# EAGLE design Ultra_Water (EAGLE 7.5.0)
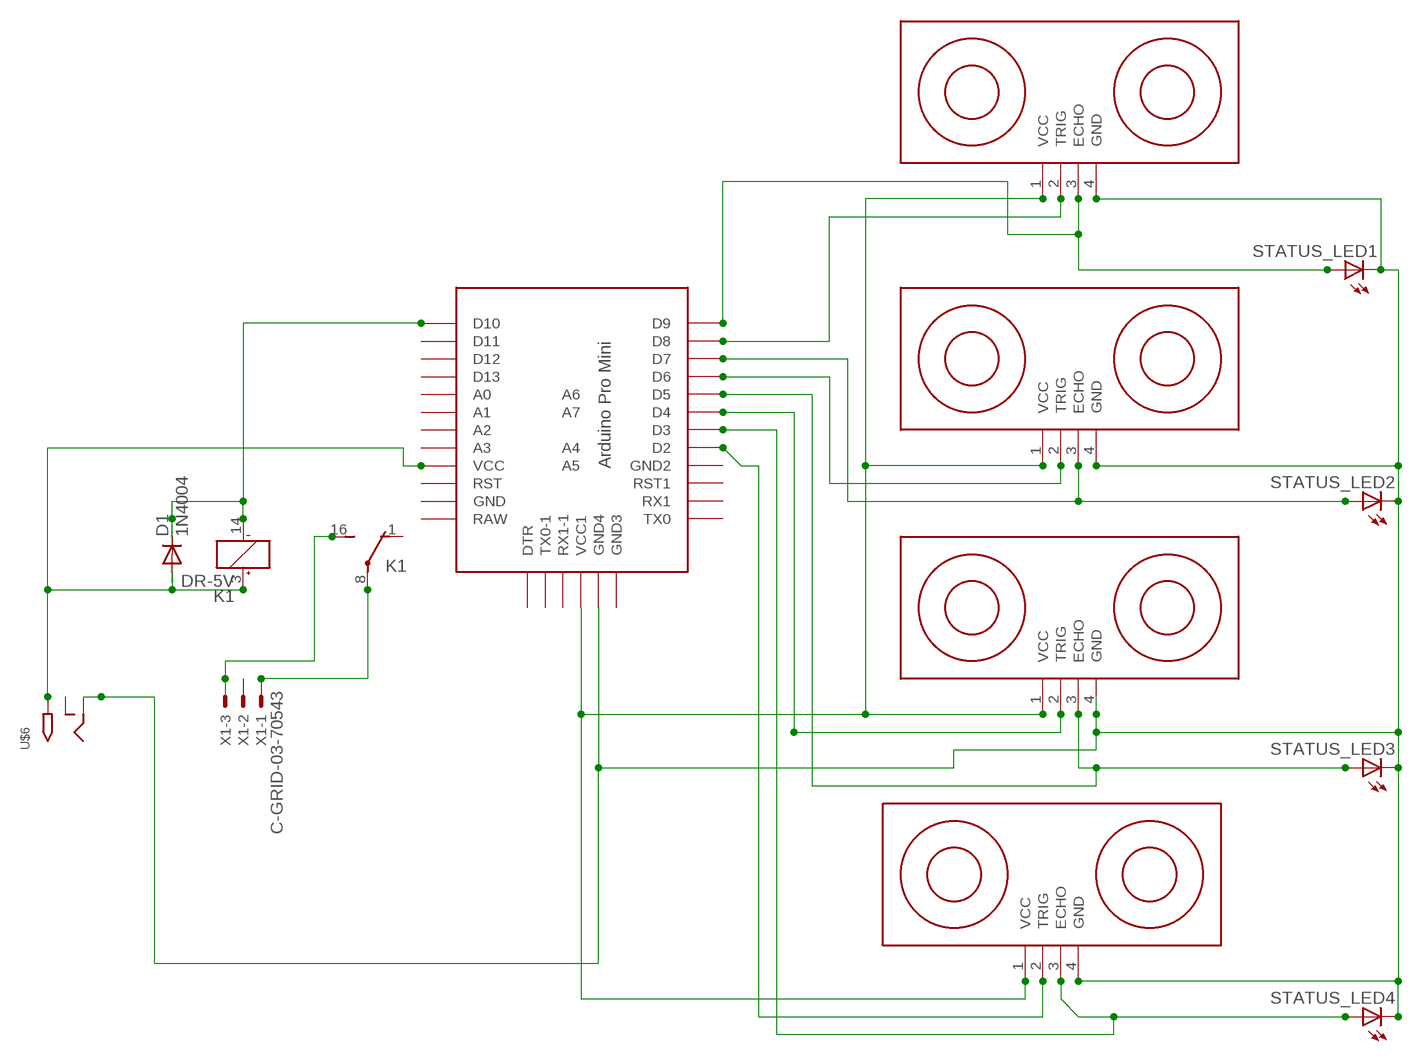
[diagram p0: schematic, sheet 1]

## Parts
D1  1N4004  [DO41-10]
K1  DR-5V  [DR-1]
STATUS_LED1  LED5MM  [LED5MM]
STATUS_LED2  LED5MM  [LED5MM]
STATUS_LED3  LED5MM  [LED5MM]
STATUS_LED4  LED5MM  [LED5MM]
U$1  PRO-MINI-2  [PRO-MINI-2]
U$2  ULTRASONIC-HC-SR04  [ULTRASONIC-HC-SR04]
U$3  ULTRASONIC-HC-SR04  [ULTRASONIC-HC-SR04]
U$4  ULTRASONIC-HC-SR04  [ULTRASONIC-HC-SR04]
U$5  ULTRASONIC-HC-SR04  [ULTRASONIC-HC-SR04]
U$6  2.1MMJACKTHM  [PJ-102A]
X1  C-GRID-03-70543  [70543-03]

## Nets
N$1: U$1.VCC1 U$2.1(VCC) U$3.1(VCC) U$4.1(VCC) U$5.1(VCC)
N$2: U$1.D4 U$4.2(TRIG)
N$4: STATUS_LED2.A U$1.D7 U$3.3(ECHO)
N$5: STATUS_LED1.A U$1.D9 U$2.3(ECHO)
N$6: STATUS_LED4.A U$1.D3 U$5.3(ECHO)
N$8: D1.C K1.14(-1:-) U$1.D10
N$9: D1.A K1.3(-1:+) U$1.VCC U$6.TIP
N$10: K1.8(-2:P) X1.1
N$11: STATUS_LED1.K(C) STATUS_LED2.K(C) STATUS_LED3.K(C) STATUS_LED4.K(C) U$1.GND3(GND4) U$2.4(GND) U$3.4(GND) U$4.4(GND) U$5.4(GND) U$6.RING
N$12: K1.16(-2:S) X1.3
N$13: U$1.D8 U$2.2(TRIG)
N$14: U$1.D2 U$5.2(TRIG)
N$15: U$1.D6 U$3.2(TRIG)
N$16: STATUS_LED3.A U$1.D5 U$4.3(ECHO)
Unconnected: K1.1(-2:O) U$1.A0 U$1.A1 U$1.A2 U$1.A3 U$1.A4 U$1.A5 U$1.A6 U$1.A7 U$1.D11 U$1.D12 U$1.D13 U$1.DTR U$1.GND U$1.GND1(GND2) U$1.GND2(GND3) U$1.RAW U$1.RST U$1.RST1 U$1.RX1 U$1.RX1-1 U$1.TX0 U$1.TX0-1 U$6.RING_SW X1.2

## Library data of the parts
D1 = diode:1N4004: DIODE general purpose rectifier, 1 A
K1 = relay:DR-*V: HIGHLY RELIABLE MINIATURE DIP RELAYS NAiS Source: www.mew-europe.com/ac/download/ datasheet/relay/dr_en.pdf; MPN: DR-5V; OC_FARNELL: 1124065; OC_NEWARK: 24M1478
STATUS_LED1-STATUS_LED4 = adafruit:LED: LED OSRAM: - CHIPLED LG R971, LG N971, LY N971, LG Q971, LY Q971, LO R971, LY R971 LH N974, LH R974 LS Q976, LO Q976, LY Q976 LO Q996 - Hyper CHIPLED LW Q18S LB Q993, LB Q99A, LB R99A - SideLED LS A670, LO A670, LY A670, LG A670, LP A670 LB A673, LV A673, LT A673, LW A673 LH A674 LY A675 LS A676, LA A676, LO A676, LY A676, LW A676 LS A679, LY A679, LG A679 - Hyper Micro SIDELED® LS Y876, LA Y876, LO Y876, LY Y876 LT Y87S - SmartLED LW L88C, LW L88S LB L89C, LB L89S, LG L890 LS L89K, LO L89K, LY L89K LS L896, LA L896, LO L896, LY L896 - TOPLED LS T670, LO T670, LY T670, LG T670, LP T670 LSG T670, LSP T670, LSY T670, LOP T670, LYG T670 LG T671, LOG T671, LSG T671 LB T673, LV T673, LT T673, LW T673 LH T674 LS T676, LA T676, LO T676, LY T676, LB T676, LH T676, LSB T676, LW T676 LB T67C, LV T67C, LT T67C, LS T67K, LO T67K, LY T67K, LW E67C LS E67B, LA E67B, LO E67B, LY E67B, LB E67C, LV E67C, LT E67C LW T67C LS T679, LY T679, LG T679 LS T770, LO T770, LY T770, LG T770, LP T770 LB T773, LV T773, LT T773, LW T773 LH T774 LS E675, LA E675, LY E675, LS T675 LS T776, LA T776, LO T776, LY T776, LB T776 LHGB T686 LT T68C, LB T68C - Hyper Mini TOPLED® LB M676 - Mini TOPLED Santana® LG M470 LS M47K, LO M47K, LY M47K Source: http://www.osram.convergy.de/
U$1 = Arduino-clone:PRO-MINI-2: Arduino Pro Mini Layout 2 Sparkfun.com
U$2-U$5 = diy-modules:ULTRASONIC-HC-SR04: Ultrasonic Ranging Module HC-SR04
U$6 = adafruit:2.1MMJACK: 2.1mm x 5.5mm THM DC jack with internal switch. Digikey part #PJ-102A, 4UCON part #05537 2.1mm x 5.5mm SMT DC jack with internal switch. Digikey part #PJ-002A-SMT, 4UCON part #03267 By microbuilder.eu & adafruit.com
X1 = con-molex:C-GRID-03: CONNECTOR wire to board 2.54 mm (0.100") pitch header; OC_FARNELL: unknown; OC_NEWARK: unknown

## Board
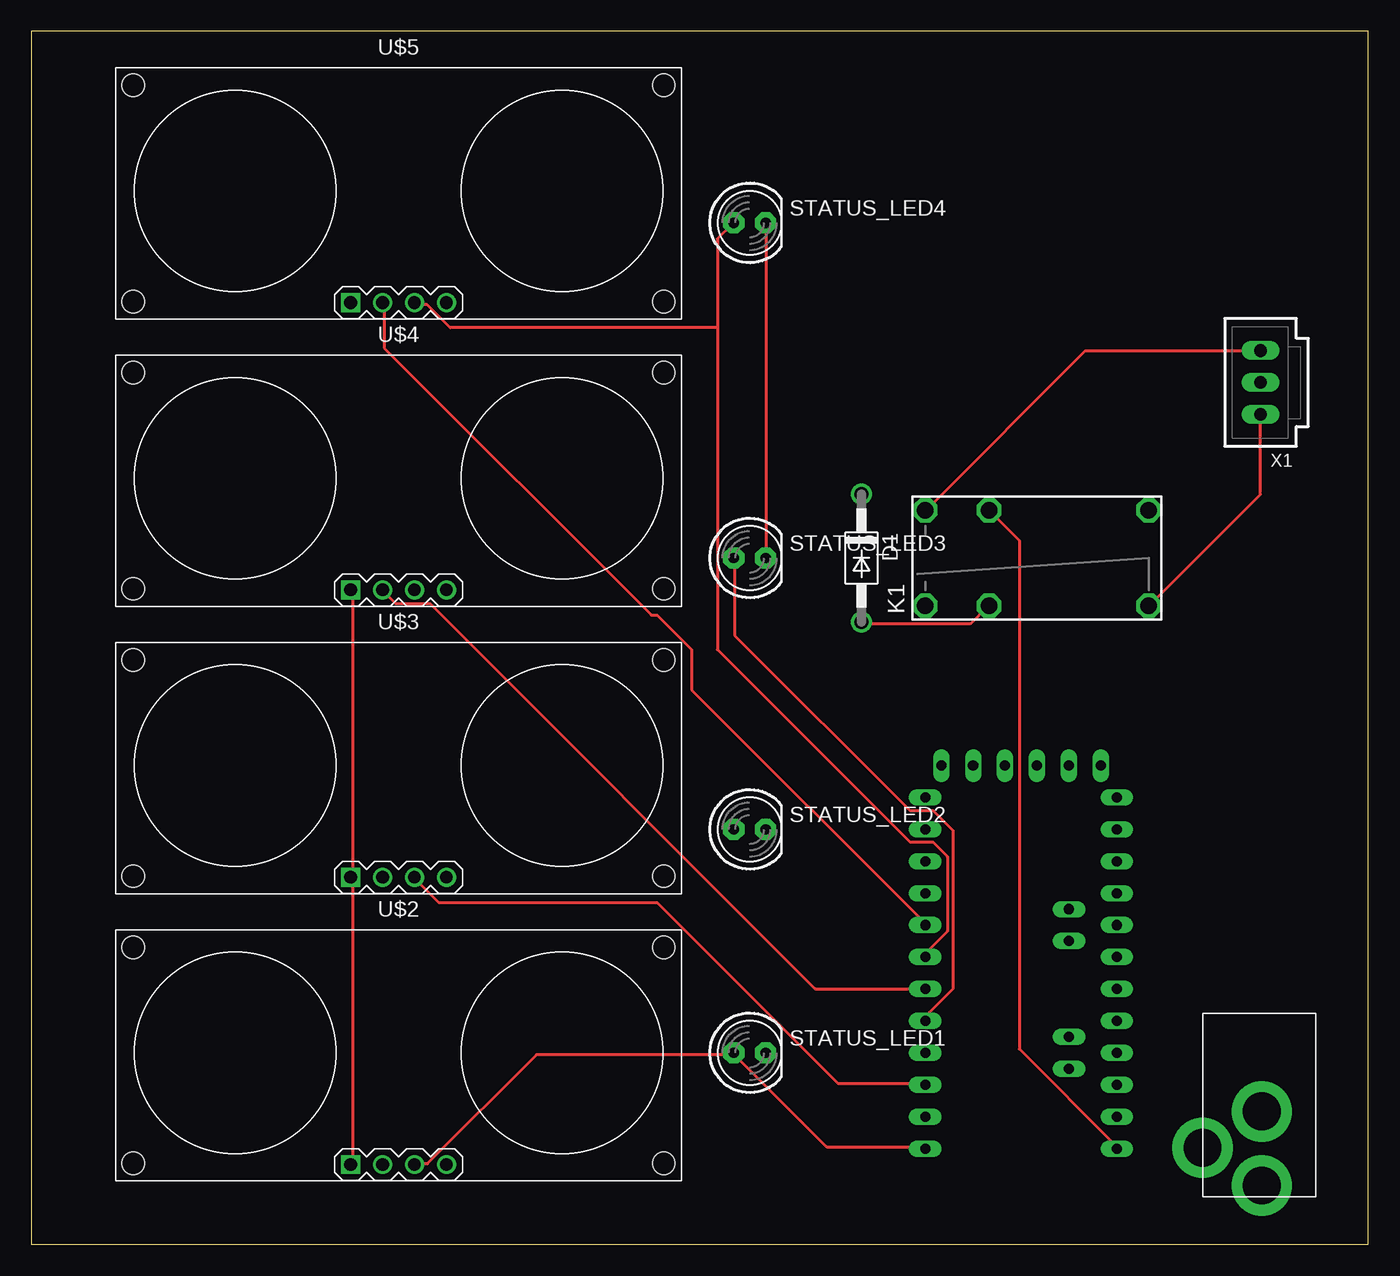
[diagram p1: board, top side]
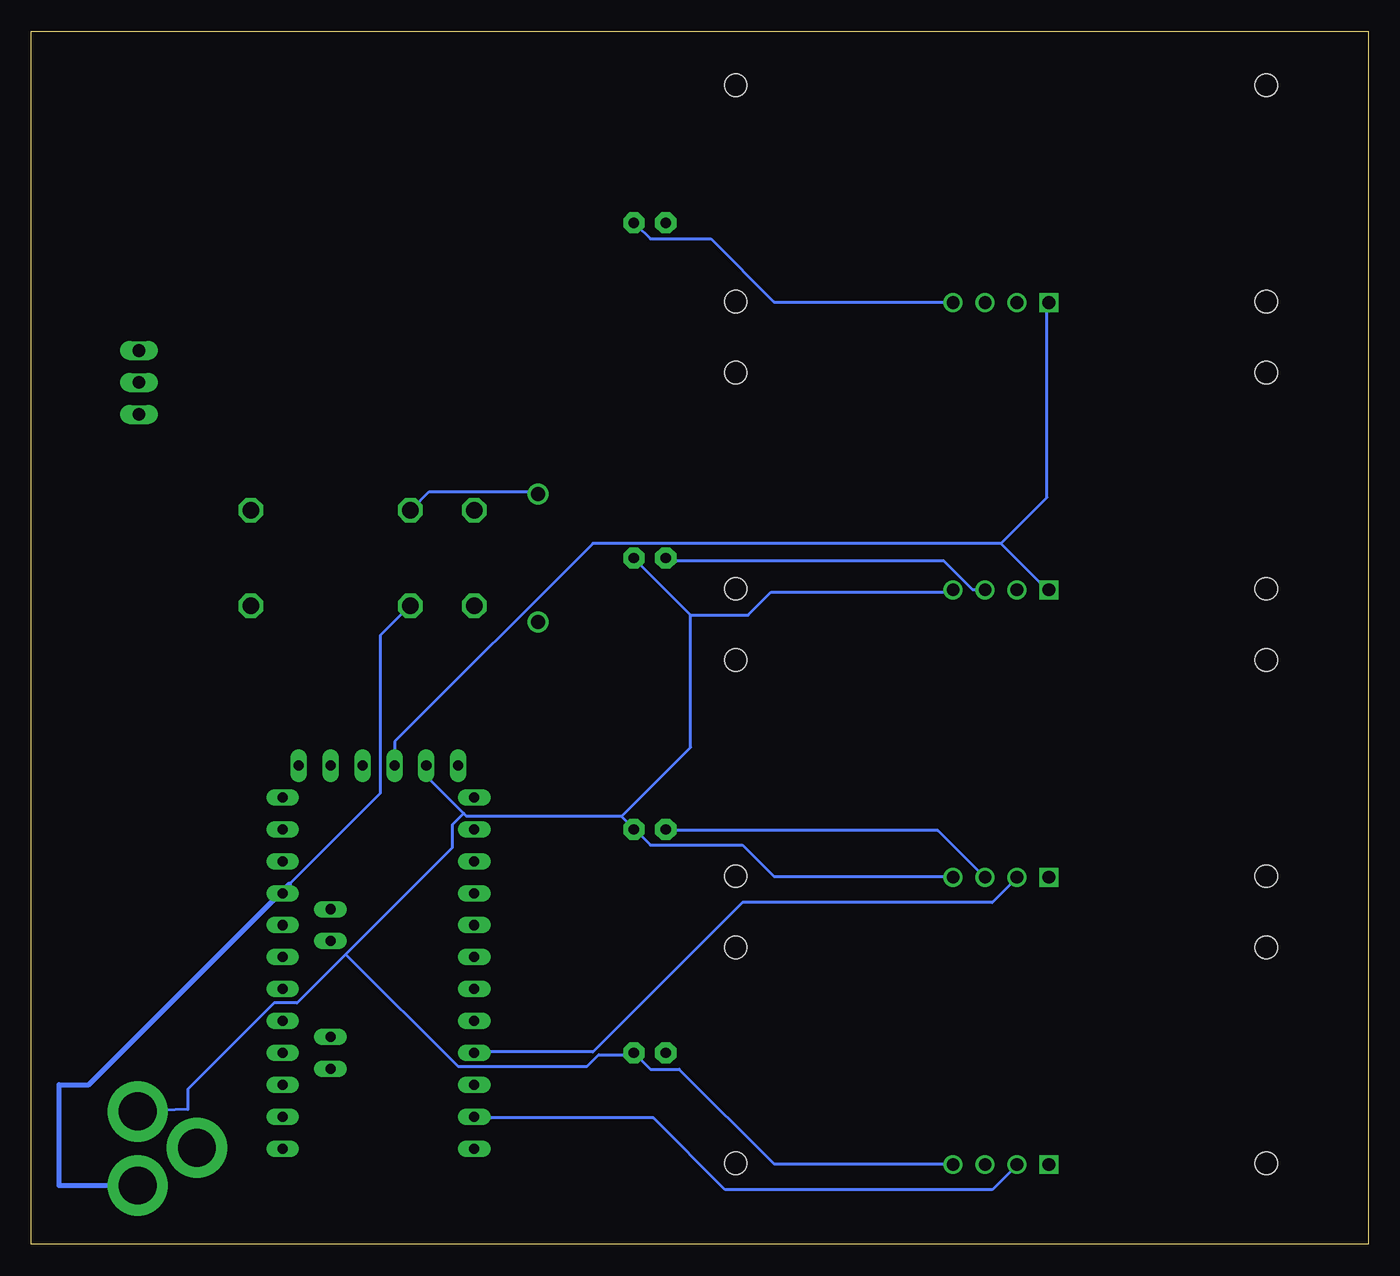
[diagram p2: board, bottom side, seen from below]

Size 106.35 x 96.51 mm. Coordinates in mm from the lower left corner, seen from the top.
Outline: 0,0 106.35,0 106.35,96.51 0,96.51 0,0
Copper layers (1*16): Top 0.035mm / dielectric 1.5mm / Bottom 0.035mm
Design rules "default": minimum track width 10mil, minimum drill 24mil, track to track 8mil, track to pad 8mil, pad to pad 8mil, via to via 8mil, smd to smd 8mil, copper to edge 40mil, drill to drill 8mil, minimum pad ring 10mil, minimum via ring 8mil, stop-mask expansion 4mil, vias tented up to drill 0mil, thermal gap 10mil

### Footprints (pad centres in the part's own frame; a part is rotated, then mirrored left to right if it is on the bottom)
DO41-10 = drill 1.118: A 5.08,0; C -5.08,0
DR-1 = drill 1.3 octagon: 1 -8.89,-3.81; 3 -3.81,-3.81; 8 8.89,-3.81; 9 8.89,3.81; 14 -3.81,3.81; 16 -8.89,3.81
LED5MM = drill 0.813 pad 1.676 octagon: A -1.27,0; K 1.27,0
PRO-MINI-2 = drill 0.8 long: A0 6.35,2.54; A1 6.35,0; A2 6.35,-2.54; A3 6.35,-5.08; A4 2.54,1.27; A5 2.54,3.81; A6 2.54,-8.89; A7 2.54,-6.35; D2 -8.89,2.54; D3 -8.89,0; D4 -8.89,-2.54; D5 -8.89,-5.08; D6 -8.89,-7.62; D7 -8.89,-10.16; D8 -8.89,-12.7; D9 -8.89,-15.24; D10 6.35,-15.24; D11 6.35,-12.7; D12 6.35,-10.16; D13 6.35,-7.62; DTR 5.08,15.24; GND 6.35,10.16; GND1 -8.89,5.08; GND2 -7.62,15.24; GND3 -5.08,15.24; RAW 6.35,12.7; RST 6.35,7.62; RST1 -8.89,7.62; RX1 -8.89,10.16; RX1-1 0,15.24; TX0 -8.89,12.7; TX0-1 2.54,15.24; VCC 6.35,5.08; VCC1 -2.54,15.24
ULTRASONIC-HC-SR04 = drill 1 square: 1 -3.81,-8.89 | drill 1: 2 -1.27,-8.89; 3 1.27,-8.89; 4 3.81,-8.89 | hole 1.8: -21.1,8.4; -21.1,-8.8; 21.1,-8.8; 21.1,8.4
PJ-102A = drill 3 pad 4.8: RING 0.1,-3.39; RING_SW -4.6,-6.29; TIP 0.1,-9.29
70543-03 = drill 1.016 long: 1 -2.54,0; 2 0,0; 3 2.54,0

### Placement (x,y rotation side)
D1  66.04,54.61 270 top
K1  80.01,54.61 0 top
STATUS_LED1  57.15,15.24 0 top
STATUS_LED2  57.15,33.02 0 top
STATUS_LED3  57.15,54.61 0 top
STATUS_LED4  57.15,81.28 0 top
U$1  80.01,22.86 0 top
U$2  29.21,15.24 0 top
U$3  29.21,38.1 0 top
U$4  29.21,60.96 0 top
U$5  29.21,83.82 0 top
U$6  97.79,13.97 0 top
X1  97.79,68.58 90 top

### Tracks (layer width: path | path; a pad name or v marks a point on that pad's centre or on a via)
N$1
  Top 0.254: U$2.1 25.55,6.4 25.55,29.03 U$3.1 25.55,29.26 25.55,51.89 U$4.1
  Bottom 0.254: 29.21,55.78 61.67,55.78 77.44,40.01 77.44,38.18 U$1.VCC1 | 29.21,55.78 25.55,52.12 U$4.1 | 29.21,55.78 25.55,59.44 25.55,74.75 U$5.1
N$2
  Top 0.254: U$1.D4 71.04,20.34 62.36,20.34 31.73,50.98 28.98,50.98 28.07,51.89 U$4.2
N$4
  Top 0.254: U$1.D7 71.04,12.8 64.19,12.8 49.78,27.2 32.41,27.2 30.58,29.03 U$3.3
  Bottom 0.254: STATUS_LED2.A 55.73,32.92 34.24,32.92 30.58,29.26 U$3.3
N$5
  Top 0.254: U$1.D9 71.04,7.77 63.27,7.77 55.96,15.09 STATUS_LED1.A 55.73,15.09 40.18,15.09 31.5,6.4 30.58,6.4 U$2.3
N$6
  Top 0.254: 54.59,72.92 54.59,80.01 55.73,81.15 STATUS_LED4.A | 54.59,72.92 54.59,47.32 69.9,32 71.73,32 72.87,30.86 72.87,24.92 71.27,23.32 71.27,22.86 U$1.D3 | 54.59,72.92 33.33,72.92 31.5,74.75 30.58,74.75 U$5.3
N$8
  Top 0.254: U$1.D10 86.36,7.77 78.59,15.54 78.59,56.01 76.3,58.29 K1.14
  Bottom 0.254: D1.C 66.24,59.89 74.7,59.89 76.07,58.52 K1.14
N$9
  Top 0.254: D1.A 66.24,49.38 74.7,49.38 76.07,50.75 K1.3
  Bottom 0.254: U$1.VCC 86.36,28.12 85.81,28.66 78.59,35.89 78.59,48.46 76.3,50.75 K1.3
  Bottom 0.406: U$6.TIP 104.14,4.68 104.14,12.7 101.78,12.7 85.81,28.66
N$10
  Top 0.254: X1.1 97.79,59.66 89.1,50.98 K1.8
N$11
  Top 0.254: STATUS_LED4.K 58.47,81.15 58.47,54.63 STATUS_LED3.K
  Bottom 0.254: U$2.4 33.1,6.4 47.27,6.4 54.81,13.95 57.1,13.95 58.24,15.09 STATUS_LED1.K 58.47,15.09 61.21,15.09 62.13,14.17 72.41,14.17 81.33,23.09 | U$5.4 33.1,74.98 47.27,74.98 52.3,80.01 57.1,80.01 58.24,81.15 STATUS_LED4.K | 53.9,50.06 49.33,50.06 47.5,51.89 33.1,51.89 U$4.4 | 53.9,50.06 58.24,54.41 STATUS_LED3.K | U$1.GND3 74.93,37.26 71.96,34.29 | 71.96,34.29 71.73,34.06 59.38,34.06 | 59.38,34.06 58.47,33.15 STATUS_LED2.K 58.24,32.92 57.1,31.77 49.78,31.77 47.27,29.26 33.1,29.26 U$3.4 | 81.33,23.09 72.87,31.55 72.87,33.38 71.96,34.29 | 81.33,23.09 85.22,19.2 87.05,19.2 93.9,12.34 93.9,10.74 U$6.RING | 53.9,50.06 53.9,39.55 59.38,34.06
N$12
  Top 0.254: X1.3 97.79,71.09 83.84,71.09 71.27,58.52 K1.16
N$13
  Bottom 0.254: U$1.D8 71.04,10.06 56.87,10.06 51.16,4.34 29.9,4.34 28.07,6.17 U$2.2
N$14
  Top 0.254: U$1.D2 71.04,25.6 52.53,44.12 52.53,47.32 49.78,50.06 49.33,50.06 28.07,71.32 28.07,74.75 U$5.2
N$15
  Bottom 0.254: U$1.D6 71.04,15.32 61.67,15.32 49.78,27.2 29.9,27.2 28.07,29.03 U$3.2
N$16
  Top 0.254: U$1.D5 71.27,17.83 71.27,18.29 73.33,20.34 73.33,32.92 71.73,34.52 69.9,34.52 55.96,48.46 55.96,54.41 STATUS_LED3.A
  Bottom 0.254: U$4.3 30.58,52.12 31.5,52.12 33.78,54.41 55.73,54.41 STATUS_LED3.A